# Altium schematic sheet FPGA_SpW_Misc.SchDoc: SVPXFMC Carrier 3U
size 420 x 297 mm; CheckedBy: \; Author: G.Kasprowicz; CompanyName: ISE; DrawnBy: T.Przywozki; Organization: WUT ISE; Address1: Warsaw University of Technology; Address2: Nowowiejska 15/19 00-665 Warsaw; Revision: 1.0.; SheetNumber: 11; SheetTotal: 20; Project: SVPXFMC Carrier 3U; ModifiedBy: -; CheckedDate: -; Title2: FPGA SpaceWire; DivGrp: ISE; Designer: G. Kasprowicz
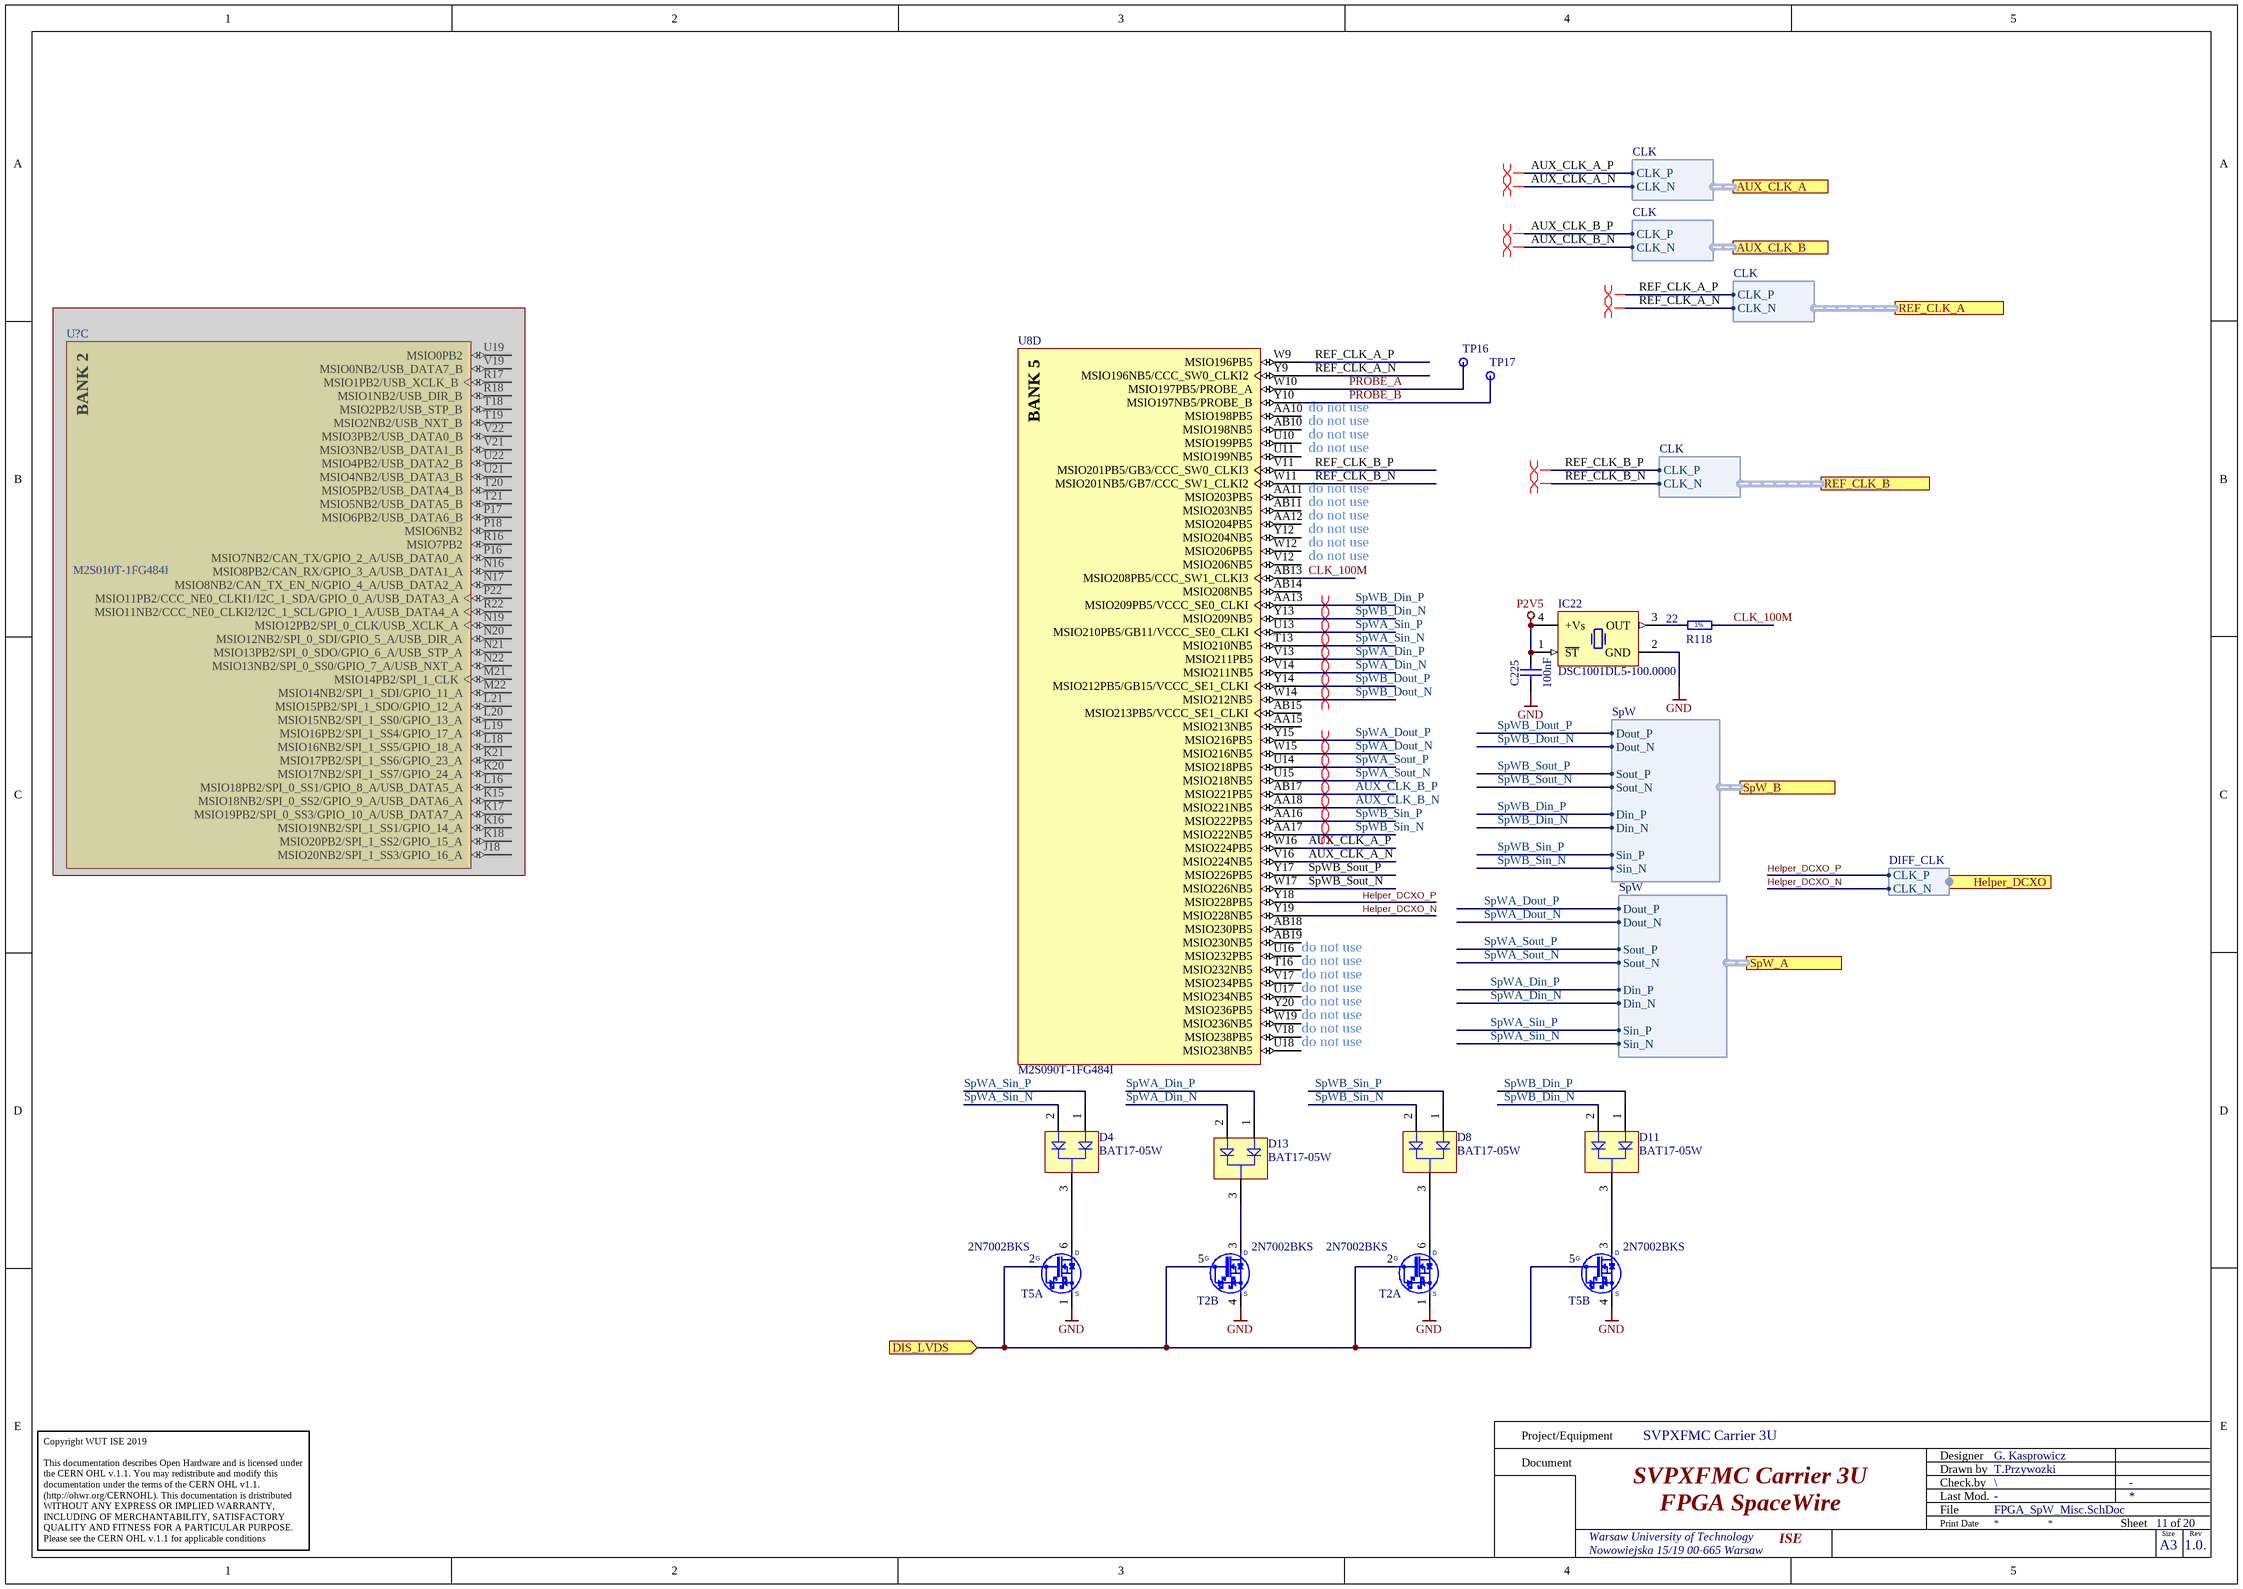
[diagram p0: FPGA_SpW_Misc.SchDoc]

## Parts
C225  100nF  [CAPC0603X33N]
D4  BAT17-05W  [INF-SOT323_N]
D8  BAT17-05W  [INF-SOT323_N]
D11  BAT17-05W  [INF-SOT323_N]
D13  BAT17-05W  [INF-SOT323_N]
IC22  DSC1001DL5-100.0000  [OSC_MICREL_2520]
R118  22  [RESC1005X40N]
T2  2N7002BKS  [SOT65P210X110-6N]  (parts A,B of 2)
T5  2N7002BKS  [SOT65P210X110-6N]  (parts A,B of 2)
TP16  Test Point  [TPS127]  (value not drawn)
TP17  Test Point  [TPS127]  (value not drawn)
U8  M2S090T-1FG484I  [MCSM-FG-484_V]  (part D of 15)
U?  M2S010T-1FG484I  [MCSM-FG-484_V]  (part C of 16)  (masked out: inside a compile mask, not in the netlist)

## Ports
AUX_CLK_A (harness CLK), AUX_CLK_B (harness CLK), DIS_LVDS (in), Helper_DCXO (harness DIFF_CLK), REF_CLK_A (harness CLK), REF_CLK_B (harness CLK), SpW_A (harness SpW), SpW_B (harness SpW)

## Harnesses
SpW: Sout_P, Sout_N, Dout_P, Dout_N, Sin_P, Sin_N, Din_P, Din_N
CLK: CLK_P, CLK_N
DIFF_CLK: CLK_N, CLK_P

## Nets
GND: C225.1 IC22.2(GND) T2.1(S) T2.4(S) T5.1(S) T5.4(S)
P2V5: C225.2 IC22.1(~{ST}) IC22.4(+Vs)
AUX_CLK_A_N: U8.V16(MSIO224NB5) ; port AUX_CLK_A.CLK_N
AUX_CLK_A_P: U8.W16(MSIO224PB5) ; port AUX_CLK_A.CLK_P
AUX_CLK_B_N: U8.AA18(MSIO221NB5) ; port AUX_CLK_B.CLK_N
AUX_CLK_B_P: U8.AB17(MSIO221PB5) ; port AUX_CLK_B.CLK_P
CLK_100M: R118.2 U8.AB13(MSIO208PB5/CCC_SW1_CLKI3)
DIS_LVDS: T2.2(G) T2.5(G) T5.2(G) T5.5(G) ; port DIS_LVDS
Helper_DCXO_N: U8.Y19(MSIO228NB5) ; port Helper_DCXO.CLK_N
Helper_DCXO_P: U8.Y18(MSIO228PB5) ; port Helper_DCXO.CLK_P
PROBE_A: TP16.1 U8.W10(MSIO197PB5/PROBE_A)
PROBE_B: TP17.1 U8.Y10(MSIO197NB5/PROBE_B)
REF_CLK_A_N: U8.Y9(MSIO196NB5/CCC_SW0_CLKI2) ; port REF_CLK_A.CLK_N
REF_CLK_A_P: U8.W9(MSIO196PB5) ; port REF_CLK_A.CLK_P
REF_CLK_B_N: U8.W11(MSIO201NB5/GB7/CCC_SW1_CLKI2) ; port REF_CLK_B.CLK_N
REF_CLK_B_P: U8.V11(MSIO201PB5/GB3/CCC_SW0_CLKI3) ; port REF_CLK_B.CLK_P
SpWA_Din_N: D13.2(A2) U8.V14(MSIO211NB5) ; port SpW_A.Din_N
SpWA_Din_P: D13.1(A1) U8.V13(MSIO211PB5) ; port SpW_A.Din_P
SpWA_Dout_N: U8.W15(MSIO216NB5) ; port SpW_A.Dout_N
SpWA_Dout_P: U8.Y15(MSIO216PB5) ; port SpW_A.Dout_P
SpWA_Sin_N: D4.2(A2) U8.T13(MSIO210NB5) ; port SpW_A.Sin_N
SpWA_Sin_P: D4.1(A1) U8.U13(MSIO210PB5/GB11/VCCC_SE0_CLKI) ; port SpW_A.Sin_P
SpWA_Sout_N: U8.U15(MSIO218NB5) ; port SpW_A.Sout_N
SpWA_Sout_P: U8.U14(MSIO218PB5) ; port SpW_A.Sout_P
SpWB_Din_N: D11.2(A2) U8.Y13(MSIO209NB5) ; port SpW_B.Din_N
SpWB_Din_P: D11.1(A1) U8.AA13(MSIO209PB5/VCCC_SE0_CLKI) ; port SpW_B.Din_P
SpWB_Dout_N: U8.W14(MSIO212NB5) ; port SpW_B.Dout_N
SpWB_Dout_P: U8.Y14(MSIO212PB5/GB15/VCCC_SE1_CLKI) ; port SpW_B.Dout_P
SpWB_Sin_N: D8.2(A2) U8.AA17(MSIO222NB5) ; port SpW_B.Sin_N
SpWB_Sin_P: D8.1(A1) U8.AA16(MSIO222PB5) ; port SpW_B.Sin_P
SpWB_Sout_N: U8.W17(MSIO226NB5) ; port SpW_B.Sout_N
SpWB_Sout_P: U8.Y17(MSIO226PB5) ; port SpW_B.Sout_P
NetD4_3: D4.3(K) T5.6(D)
NetD8_3: D8.3(K) T2.6(D)
NetD11_3: D11.3(K) T5.3(D)
NetD13_3: D13.3(K) T2.3(D)
NetIC22_3: IC22.3(OUT) R118.1

Not connected (* = marked no-connect by the designer): U8 AA10(MSIO198PB5) AA11(MSIO203PB5) AA12(MSIO204PB5) AA15(MSIO213NB5) AB10(MSIO198NB5) AB11(MSIO203NB5) AB14(MSIO208NB5) AB15(MSIO213PB5/VCCC_SE1_CLKI) AB18(MSIO230PB5) AB19(MSIO230NB5) T16(MSIO232NB5) U10(MSIO199PB5) U11(MSIO199NB5) U16(MSIO232PB5) U17(MSIO234NB5) U18(MSIO238NB5) V12(MSIO206NB5) V17(MSIO234PB5) V18(MSIO238PB5) W12(MSIO206PB5) W19(MSIO236NB5) Y12(MSIO204NB5) Y20(MSIO236PB5)

## Layout directives
differential pair: AUX_CLK_A_N, AUX_CLK_A_P, AUX_CLK_B_N, AUX_CLK_B_P, REF_CLK_A_N, REF_CLK_A_P, REF_CLK_B_N, REF_CLK_B_P, SpWA_Din_N, SpWA_Din_P, SpWA_Dout_N, SpWA_Dout_P, SpWA_Sin_N, SpWA_Sin_P, SpWA_Sout_N, SpWA_Sout_P, SpWB_Din_N, SpWB_Din_P, SpWB_Dout_N, SpWB_Dout_P, SpWB_Sin_N, SpWB_Sin_P

## Notes on the sheet
- (near U8) do not use
- Project/Equipment
- Document
- Designer
- Drawn by
- Check.by
- File
- Last Mod.
- Print Date
- Sheet
- Size
- A3
- of
- Rev
- Copyright WUT ISE 2019
  This documentation describes Open Hardware and is licensed under the CERN OHL v.1.1. You may redistribute and modify this documentation under the terms of the CERN OHL v1.1.
  (http://ohwr.org/CERNOHL). This documentation is dristributed WITHOUT ANY EXPRESS OR IMPLIED WARRANTY, INCLUDING OF MERCHANTABILITY, SATISFACTORY QUALITY AND FITNESS FOR A PARTICULAR PURPOSE. Please see the CERN OHL v.1.1 for applicable conditions
- (in symbol CMP-0959-00045-1, part D) BANK 5
- (in symbol CMP-0959-00069-1, part C) BANK 2
- (in symbol R0402_22R_1%_0.0625W_100PPM) 1%

## Library data of the parts
C225 = CC0201_100NF_6.3V_10%_X5R: Non-polarised capacitor; Manufacturer: GENERIC; Part Description: SMD Multilayer Chip Ceramic Capacitor; Manufacturer1 Part Number: 02016D104KAT2A; Voltage: 6.3V; TC: X5R; Tolerance: ±10%; Part Number: CC0201_100NF_6.3V_10%_X5R; Component Kind: Standard; Component Type: Standard; Pin Count: 2; Value: 100nF; Status: Not Recommended; Manufacturer Part Number: CC0201_100NF_6.3V_10%_X5R; Case: 0201; Mounted: Yes; Socket: No; SMD: Yes; Sense: No; Manufacturer1 Example: AVX; Manufacturer1 ComponentHeight: 0.33mm; HelpURL: \\cern.ch\dfs\Applications\Altium\Datasheets\CC0201_X5R_AVX.pdf; Author: CERN DEM JLC; CreateDate: 03/12/2007; LatestRevisionDate: 03/12/2007
D4 D8 D11 D13 = CMP-1154-00018-1: Dual Silicon Schottky Diode, 130 mA IF Max, SOT323, Green; Manufacturer: Infineon; VF (typ): 0.34 V; CT (typ): 0.55 pF; Green: yes; Group: RF Mixer; IF (max): 130 mA; VR (max): 4 V; ComponentLink1URL: http://www.infineon.com/; Mounting Technology: Surface Mount; Halogen-free: yes; DatasheetVersion: Jun-2011; ComponentLink3Description: Package Specification; ComponentLink2URL: http://www.infineon.com/dgdl/bat17series.pdf?folderId=db3a304314dca3890114ff6812070b44&fileId=db3a304314dca389011517d785d60d4e&location=en.Products.RF.RF_Mixer___Detector_Schottky_Diodes.DATASHEET.bat17series.pdf; PartNumber: BAT17-05W; ComponentLink3URL: http://www.infineon.com/dgdl/SOT323-Package_Overview.pdf?folderId=db3a30431936bc4b0119533e1dcb3c92&fileId=db3a30431936bc4b011953495f283cb1; Configuration: Dual; PackageDescription: 3-Pin Small Outline Transistor Package, 1.25 x 2 mm Body, 0.65 mm Pitch; ComponentLink1Description: Manufacturer URL; ComponentLink2Description: Datasheet; PackageReference: SOT323
IC22 = OSC_DSC1001DL5-100.0000: MEMS 100MHz oscillator; Manufacturer: Micrel; Part Description: MEMS Oscillator 100MHz; Bonding: No; PressFit: No; Case: *; Component Kind: Standard; Component Type: Standard; ComponentHeigth: *; CreateDate: 2018-01-01; Device: DSC1001DL5-100.0000; Footprint: *; HelpURL: *; LatestRevisionDate: 2018-01-01; Manufacturer Part Number: DSC1001DL5-100.0000; Mounted: Yes; PackageDescription: MICREL SMD Oscillator, QFN, 4 pins, 2.5mm x 2.0mm; Part Number: DSC1001DL5-100.0000; Pin Count: 4; Sense: No; SMD: Yes; Socket: No; Value: *
R118 = R0402_22R_1%_0.0625W_100PPM: Resistor - 1%; Part Description: General Purpose Thick Film Chip Resistor; Manufacturer: GENERIC; Manufacturer1 Part Number: 232270672209L; TC: ±100ppm/°C; PressFit: No; Part Number: R0402_22R_1%_0.0625W_100PPM; Component Kind: Standard; Component Type: Standard; Pin Count: 2; Value: 22; Status: Not Recommended; Power: 0.0625W; Tolerance: ±1%; Manufacturer Part Number: R0402_22R_1%_0.0625W_100PPM; Case: 0402; Mounted: Yes; Sense: No; Socket: No; SMD: Yes; Manufacturer1 Example: YAGEO PHYCOMP; Manufacturer1 ComponentHeight: 0.4mm; HelpURL: \\cern.ch\dfs\Applications\Altium\Datasheets\R0402_Phycomp_RC0402.pdf; Author: CERN DEM JLC; CreateDate: 03/12/2007; LatestRevisionDate: 17/10/2012
T2 T5 = 2N7002BKS: 60V, 300mA Dual N-Channel Trench MOSFET; Manufacturer: NXP SEMICONDUCTORS; Manufacturer Part Number: 2N7002BKS6; PressFit: No; Bonding: No; Part Number: 2N7002BKS; Component Kind: Standard; Component Type: Standard; Device: 2N7002BKS; PackageDescription: SOT363, SC70-6, SOT, 0.65mm Pitch, 6 pin, 1.25mm W X 2.00mm L X 1.10mm H, IPC Medium Density; Part Description: 60 V, 300 mA Dual N-Channel Trench MOSFET; Pin Count: 4; Case: SOT363; Mounted: Yes; Socket: No; SMD: Yes; Sense: No; ComponentHeight: 1.1mm; HelpURL: \\cern.ch\dfs\Applications\Altium\Datasheets\2N7002BKS.pdf; Author: CERN DEM JLC; CreateDate: 2012-11-27; LatestRevisionDate: 2012-11-27
TP16 TP17 = SMD_PAD_1.27X1.27MM: Part Description: 1.27mm x 1.27mm PCB Copper Area (SMD Test Point); Mounted: No; Part Number: SMD_PAD_1.27X1.27MM; Component Kind: Standard (No BOM); Component Type: Standard (No BOM); Pin Count: 1; Family: Test Point; Socket: No; SMD: Yes; Sense: No; Status: None; ComponentHeight: 0mm; HelpURL: Undefined; Author: CERN DEM JLC; CreateDate: 12.01.2008; LatestRevisionDate: 12.01.2008; PackageDescription: 1.27mm x 1.27mm PCB Copper Area (SMD Test Point)
U8 = CMP-0959-00045-1: SmartFusion2 SoC FPGA, ARM Cortex-M3, 90 K LUTs, 267 User I/O, Transceiver Available, Design Security, Speed Grade 1, -40 to 100 degC, 484-Ball BGA; Manufacturer: Microsemi; Total User I/O: 267; PLLs and CCCs: 6; LSRAM 18K Blocks: 109; eNVM (K Bytes): 512; DDR Controllers (Count x Width): 1x18; Math Blocks (18x18): 84; Maximum Logic Elements: 86,316; eSRAM (K Bytes): 64; MSIOD (2.5V): 40; SERDES Lanes: 4; MSIO (3.3V): 157; Total RAM (K bits): 2074; DDRIO (2.5V): 70; uSRAM1K Blocks: 112; eSRAM (K Bytes) Non SECDED: 80; ComponentLink3URL: http://www.microsemi.com/document-portal/doc_download/131095-package-mechanical-drawings; DatasheetVersion: Rev. 5; ComponentLink3Description: Package Specification; ComponentLink1Description: Manufacturer URL; PackageReference: FG-484; RoHS: FALSE; ComponentLink1URL: http://www.microsemi.com/; Code_JEDEC: MS-034; Mounting Technology: Surface Mount; PackageDescription: 484-Ball Fine Pitch Plastic Ball Grid Array (FBGA), Body 23 x 23 mm, Pitch 1 mm; PackageVersion: Rev. 48, 11/2013; ComponentLink2URL: http://www.microsemi.com/document-portal/doc_download/130717-smartfusion2-datasheet; PartNumber: M2S090T-1FG484I; ComponentLink2Description: Datasheet; PartId: 1
U? = CMP-0959-00069-1: SmartFusion2 SoC FPGA, ARM Cortex-M3, 10 K LUTs, 233 User I/O, Transceiver Available, Design Security, Speed Grade 1, -40 to 100 degC, 484-Ball BGA; Manufacturer: Microsemi; MSIO (3.3V): 123; DDRIO (2.5V): 70; eSRAM (K Bytes): 64; uSRAM1K Blocks: 22; SERDES Lanes: 4; DDR Controllers (Count x Width): 1x18; MSIOD (2.5V): 40; Maximum Logic Elements: 12,084; eNVM (K Bytes): 256; PLLs and CCCs: 2; LSRAM 18K Blocks: 21; eSRAM (K Bytes) Non SECDED: 80; Total RAM (K bits): 400; Total User I/O: 233; PackageVersion: Rev. 48, 11/2013; ComponentLink3URL: http://www.microsemi.com/document-portal/doc_download/131095-package-mechanical-drawings; ComponentLink1Description: Manufacturer URL; DatasheetVersion: Rev. 5; RoHS: FALSE; ComponentLink2Description: Datasheet; Code_JEDEC: MS-034; ComponentLink3Description: Package Specification; ComponentLink2URL: http://www.microsemi.com/document-portal/doc_download/130717-smartfusion2-datasheet; PartNumber: M2S010T-1FG484I; ComponentLink1URL: http://www.microsemi.com/; Math Blocks (18x18): 22; Mounting Technology: Surface Mount; PackageDescription: 484-Ball Fine Pitch Plastic Ball Grid Array (FBGA), Body 23 x 23 mm, Pitch 1 mm; PackageReference: FG-484